# EAGLE schematic KELU1-0234 (EAGLE 7.6.0)
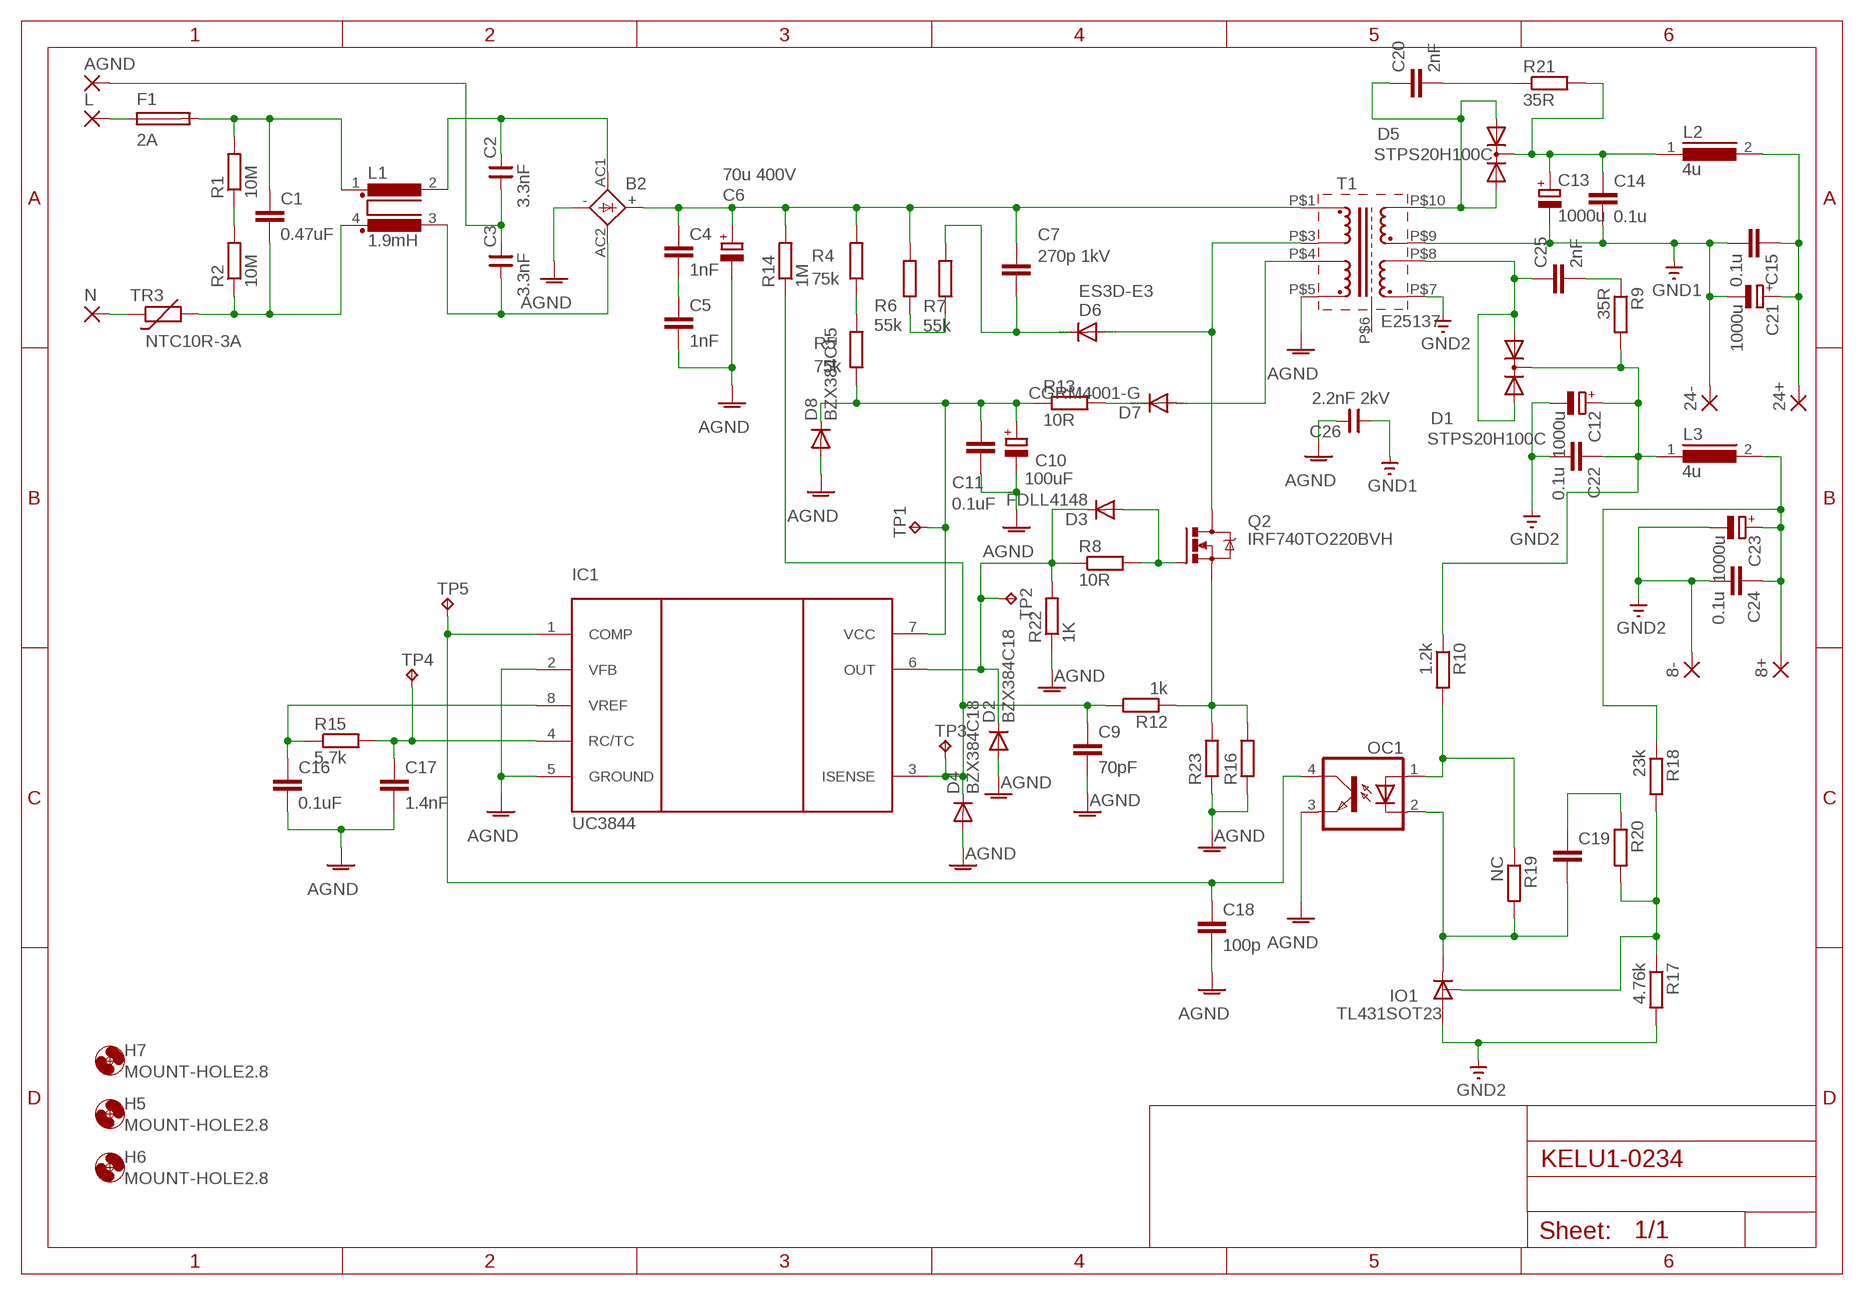
[diagram p0: schematic, sheet 1]

## Parts
8+  3,17/1,1  [3,17/1,1]
8-  3,17/1,1  [3,17/1,1]
24+  3,17/1,1  [3,17/1,1]
24-  3,17/1,1  [3,17/1,1]
AGND  3,17/1,1  [3,17/1,1]
B2  2KBP  [2KBP]
C1  0.47uF  C15/5  [C15B5]
C2  3.3nF  CNP-C085-110X050  [C085-110X050]
C3  3.3nF  CNP-C080-110X045  [C080-110X045]
C4  1nF  C-EUC1206K  [C1206K]
C5  1nF  C-EUC1206K  [C1206K]
C6  70u 400V  CPOL-EUE7.5-16  [E7,5-16]
C7  270p 1kV  C-EUC1206K  [C1206K]
C9  70pF  C-EUC0805K  [C0805K]
C10  100uF  CPOL-EUE5-5  [E5-5]
C11  0.1uF  C-EUC0805K  [C0805K]
C12  1000u  CPOL-EUE3.5-8  [E3,5-8]
C13  1000u  CPOL-EUE3.5-8  [E3,5-8]
C14  0.1u  C-EUC0805K  [C0805K]
C15  0.1u  C-EUC0805K  [C0805K]
C16  0.1uF  C-EUC0805K  [C0805K]
C17  1.4nF  C-EUC0805K  [C0805K]
C18  100p  C-EUC0805K  [C0805K]
C19  C-EUC0805K  [C0805K]
C20  2nF  C-EUC1206K  [C1206K]
C21  1000u  CPOL-EUE3.5-8  [E3,5-8]
C22  0.1u  C-EUC0805K  [C0805K]
C23  1000u  CPOL-EUE3.5-8  [E3,5-8]
C24  0.1u  C-EUC0805K  [C0805K]
C25  2nF  C-EUC1206K  [C1206K]
C26  2.2nF 2kV  CNP-C080-110X045  [C080-110X045]
D1  STPS20H100C  BYV32  [TO220ABS]
D2  BZX384C18  DIODE-SOD323-W  [SOD323-W]
D3  FDLL4148  DIODE-MINIMELF  [MINIMELF]
D4  BZX384C18  DIODE-SOD323-W  [SOD323-W]
D5  STPS20H100C  BYV32  [TO220ABS]
D6  ES3D-E3  DIODE-SMC  [SMC]
D7  CGRM4001-G  [SOD-123_MINI-SMA]
D8  BZX384C15  DIODE-SOD323-W  [SOD323-W]
F1  2A  FUSETE5  [TE5]
H5  MOUNT-HOLE2.8  [2,8]
H6  MOUNT-HOLE2.8  [2,8]
H7  MOUNT-HOLE2.8  [2,8]
IC1  UC3844  [SOIC08]
IO1  TL431SOT23  [SOT23]
L  3,17/1,1  [3,17/1,1]
L1  1.9mH  MFE  [MFE]
L2  4u  82114R  [82114R]
L3  4u  82114R  [82114R]
N  3,17/1,1  [3,17/1,1]
OC1  PC817  [DIL04]
Q2  IRF740TO220BVH  [TO220BVH]
R1  10M  R-EU_M1206  [M1206]
R2  10M  R-EU_M1206  [M1206]
R4  75k  R-EU_M1206  [M1206]
R5  75k  R-EU_M1206  [M1206]
R6  55k  R-EU_M1206  [M1206]
R7  55k  R-EU_M1206  [M1206]
R8  10R  R-EU_M1206  [M1206]
R9  35R  R-EU_M1206  [M1206]
R10  1.2k  R-EU_R0805W  [R0805W]
R12  1k  R-EU_R0805W  [R0805W]
R13  10R  R-EU_R0805W  [R0805W]
R14  1M  R-EU_M1206  [M1206]
R15  5.7k  R-EU_R0805W  [R0805W]
R16  R-EU_R2512  [R2512]
R17  4.76k  R-EU_R0805W  [R0805W]
R18  23k  R-EU_R0805W  [R0805W]
R19  NC  R-EU_R0805W  [R0805W]
R20  R-EU_R0805W  [R0805W]
R21  35R  R-EU_M1206  [M1206]
R22  1K  R-EU_M1206  [M1206]
R23  R-EU_R2512  [R2512]
T1  E25137  [E25137]
TP1  TPB1,27  [B1,27]
TP2  TPB1,27  [B1,27]
TP3  TPB1,27  [B1,27]
TP4  TPB1,27  [B1,27]
TP5  TPB1,27  [B1,27]
TR3  NTC10R-3A  THERMISTOR-5  [R-5]

## Nets
AGND: B2.- C5.2 C6.- C9.2 C10.- C11.2 C16.2 C17.2 C18.2 C26.2 D2.A D4.A D8.A IC1.2(VFB) IC1.5(GROUND) OC1.3(EMIT) R16.1 R22.1 R23.1 T1.P$5
GND1: 24-.1(P) C13.- C14.2 C15.2 C21.- C26.1 T1.P$9
GND2: 8-.1(P) C12.- C22.2 C23.- C24.2 IO1.3(A) R17.2 T1.P$7
N$1: F1.1 L.1(P)
N$2: C1.1 F1.2 L1.1 R1.2
N$3: C1.2 L1.4 R2.1 TR3.2
N$4: R1.1 R2.2
N$5: AGND.1(P) C2.1 C3.2
N$6: N.1(P) TR3.1
N$7: B2.AC1 C2.2 L1.2
N$8: B2.AC2 C3.1 L1.3
N$9: B2.+ C4.1 C6.+ C7.1 R4.2 R6.2 R14.2 T1.P$1
N$10: C4.2 C5.1
N$11: D6.A Q2.D T1.P$3
N$12: D3.A Q2.G R8.2
N$13: R4.1 R5.2
N$14: D2.C D3.C IC1.6(OUT) R8.1 R22.2 TP2.PP(TP)
N$15: R6.1 R7.1
N$16: C10.+ C11.1 D8.C IC1.7(VCC) R5.1 R13.1 TP1.PP(TP)
N$17: C7.2 D6.C R7.2
N$18: C12.+ C22.1 D1.C L3.1 R9.2 R10.1
N$19: Q2.S R12.1 R16.2 R23.2
N$20: D7.C R13.2
N$21: D7.A T1.P$4
N$22: C9.1 D4.C IC1.3(ISENSE) R12.2 R14.1 TP3.PP(TP)
N$23: OC1.1(A) R10.2 R19.1
N$24: C16.1 IC1.8(VREF) R15.1
N$25: C17.1 IC1.4(RC/TC) R15.2 TP4.PP(TP)
N$26: C20.1 D5.A1 D5.A2 T1.P$10
N$28: C13.+ C14.1 D5.C L2.1 R21.2
N$29: 24+.1(P) C15.1 C21.+ L2.2
N$30: C18.1 IC1.1(COMP) OC1.4(COL) TP5.PP(TP)
N$31: IO1.2(R) R17.1 R18.2 R20.2
N$32: C19.1 R20.1
N$33: C20.2 R21.1
N$34: C19.2 IO1.1(C) OC1.2(C) R19.2
N$35: C25.1 D1.A1 D1.A2 T1.P$8
N$36: C25.2 R9.1
N$37: 8+.1(P) C23.+ C24.1 L3.2 R18.1
Unconnected: T1.P$6

## Library data of the parts
8+ 8- 24+ 24- AGND L N = wirepad:3,17/1,1: THROUGH-HOLE PAD
B2 = rectifier:2KBP: RECTIFIER grid 3 x 3,81 mm
C1 = capacitor-wima:C: CAPACITOR naming: grid - package width
C2 C3 C26 = cap-master:CNP-: NON-POLARIZED CAP
C4 C5 C7 C20 C25 = rcl:C-EU: CAPACITOR, European symbol
C6 = rcl:CPOL-EU: POLARIZED CAPACITOR, European symbol
C9 C11 C14-C19 C22 C24 = resistor:C-EU: CAPACITOR, European symbol
C10 C12 C13 C21 C23 = resistor:CPOL-EU: POLARIZED CAPACITOR, European symbol
D1 D5 = diode:BYV32: DIODE 2 x Si diode 200 V, 20 A/230 Apeak, 25 ns
D2-D4 D8 = diode-1:DIODE-: DIODE
D6 = diode:DIODE-: DIODE
D7 = diode:CGRM400*-G: Molded plasitc,JEDEC SOD-123/Mini SMA Source: Comchip CGRM4001-G.pdf
F1 = fuse:FUSE: Fuse
H5-H7 = holes:MOUNT-HOLE: MOUNTING HOLE with drill center marker
IC1 = UC3844:UC3844: Current-Mode PWM Controller
IO1 = references:TL431: Programmable Shunt Regulator TL431 Features > Programmable Output Voltage to 36 Volts > Low Dynamic Output Impedance 0.2? Typical > Sink Current Capability of 1.0 to 100mA > Equivalent Full-Range Temperature Coefficient of 50ppm/°C Typical > Temperature Compensated For Operation Over Full Rated Operating Temperature Range > Low Output Noise Voltage > Fast Turn-on Response; MPN: TL431BFDT; OC_FARNELL: 2095471; PACKAGE: SOT23; SUPPLIER: NXP
L1 = inductors:MFE: FILTER
L2 L3 = inductors:82114R: INDUCTOR
OC1 = optocoupler:PC817: SHARP OPTO COUPLER
Q2 = transistor-power:IRF740: N-CHANNEL MOS FET
R1 R2 R4-R7 R9 R14 R16 R21 R23 = rcl:R-EU_: RESISTOR, European symbol
R8 R10 R12 R13 R15 R17-R20 R22 = resistor:R-EU_: RESISTOR, European symbol
T1 = E25137:E25137: E-25/13/7 Transformer
TP1-TP5 = testpad:TP: Test pad
TR3 = varistor:THERMISTOR: THERMISTOR